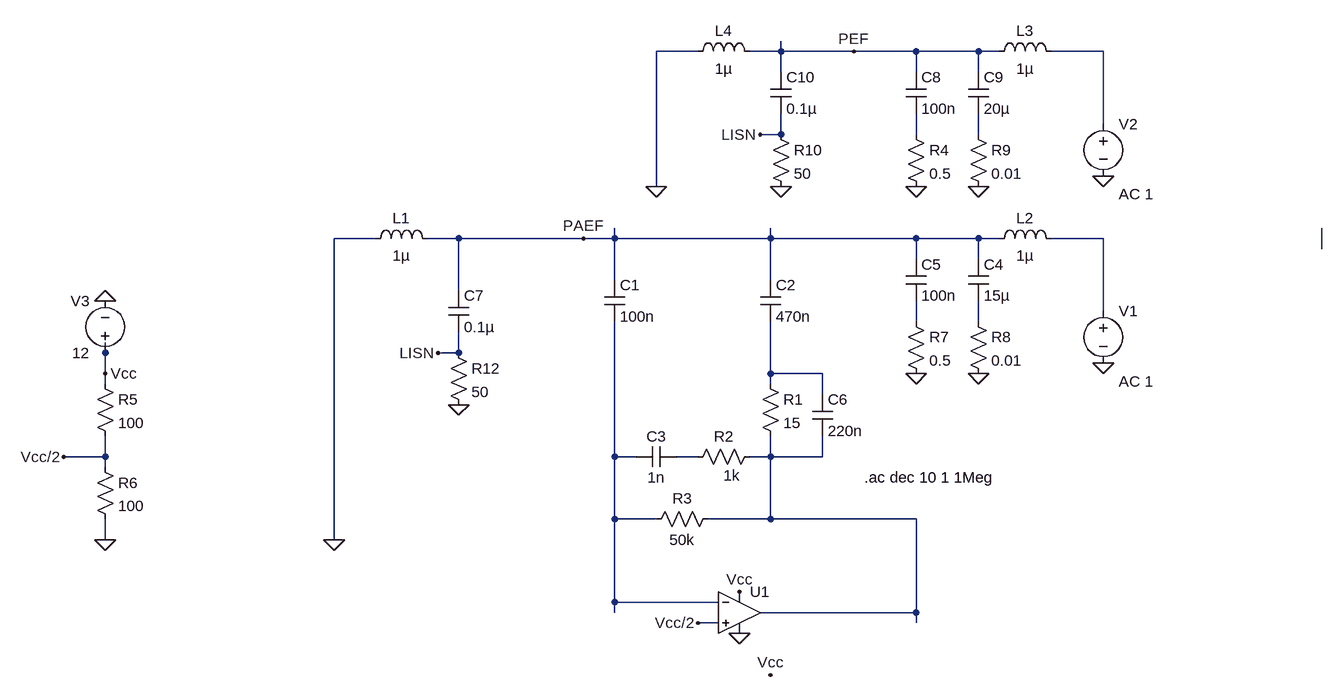
[diagram p0: schematic 440kHz-Bode.asc]
440kHz-Bode.asc, the LTspice schematic file:
Version 4
SHEET 1 3444 680
WIRE 160 -416 96 -416
WIRE 288 -416 288 -432
WIRE 288 -416 240 -416
WIRE 400 -416 288 -416
WIRE 496 -416 400 -416
WIRE 592 -416 496 -416
WIRE 624 -416 592 -416
WIRE 784 -416 704 -416
WIRE 288 -384 288 -416
WIRE 496 -384 496 -416
WIRE 592 -384 592 -416
WIRE 784 -304 784 -416
WIRE 288 -288 288 -320
WIRE 288 -288 256 -288
WIRE 496 -288 496 -320
WIRE 592 -288 592 -320
WIRE 96 -208 96 -416
WIRE -336 -128 -400 -128
WIRE -208 -128 -256 -128
WIRE -16 -128 -208 -128
WIRE 32 -128 32 -144
WIRE 32 -128 -16 -128
WIRE 272 -128 272 -144
WIRE 272 -128 32 -128
WIRE 496 -128 272 -128
WIRE 592 -128 496 -128
WIRE 624 -128 592 -128
WIRE 784 -128 704 -128
WIRE 1120 -112 1120 -144
WIRE 496 -96 496 -128
WIRE 592 -96 592 -128
WIRE 32 -64 32 -128
WIRE 272 -64 272 -128
WIRE -208 -48 -208 -128
WIRE 784 -16 784 -128
WIRE 496 0 496 -32
WIRE 592 0 592 -32
WIRE -752 48 -752 32
WIRE -208 48 -208 16
WIRE -208 48 -240 48
WIRE -752 80 -752 48
WIRE 272 80 272 0
WIRE 352 80 272 80
WIRE -752 96 -752 80
WIRE 272 96 272 80
WIRE 352 112 352 80
WIRE -752 208 -752 176
WIRE -752 208 -816 208
WIRE 32 208 32 0
WIRE 64 208 32 208
WIRE 160 208 128 208
WIRE 272 208 272 176
WIRE 272 208 240 208
WIRE 352 208 352 176
WIRE 352 208 272 208
WIRE -752 224 -752 208
WIRE 32 304 32 208
WIRE 96 304 32 304
WIRE 272 304 272 208
WIRE 272 304 176 304
WIRE 496 304 272 304
WIRE -752 336 -752 304
WIRE -400 336 -400 -128
WIRE 32 432 32 304
WIRE 192 432 32 432
WIRE 32 448 32 432
WIRE 496 448 496 304
WIRE 496 448 256 448
WIRE 192 464 160 464
WIRE 496 464 496 448
FLAG -400 336 0
FLAG -816 208 Vcc/2
FLAG -752 336 0
FLAG 496 80 0
FLAG -752 80 Vcc
FLAG 224 416 Vcc
FLAG 272 544 Vcc
FLAG 160 464 Vcc/2
FLAG 224 480 0
FLAG -752 -32 0
FLAG -208 128 0
FLAG -240 48 LISN
FLAG 784 64 0
FLAG 592 80 0
FLAG 496 -208 0
FLAG 784 -224 0
FLAG 592 -208 0
FLAG 96 -208 0
FLAG 288 -208 0
FLAG 256 -288 LISN
FLAG 400 -416 PEF
FLAG -16 -128 PAEF
DATAFLAG 128 -128 ""
DATAFLAG 400 -128 ""
DATAFLAG 752 -128 ""
DATAFLAG 752 -416 ""
DATAFLAG 752 -416 ""
SYMBOL cap 16 -64 R0
SYMATTR InstName C1
SYMATTR Value 100n
SYMBOL cap 256 -64 R0
SYMATTR InstName C2
SYMATTR Value 470n
SYMBOL res 256 80 R0
SYMATTR InstName R1
SYMATTR Value 15
SYMBOL cap 128 192 R90
WINDOW 0 0 32 VBottom 2
WINDOW 3 32 32 VTop 2
SYMATTR InstName C3
SYMATTR Value 1n
SYMBOL res 256 192 R90
WINDOW 0 0 56 VBottom 2
WINDOW 3 29 44 VTop 2
SYMATTR InstName R2
SYMATTR Value 1k
SYMBOL res 192 288 R90
WINDOW 0 0 56 VBottom 2
WINDOW 3 32 56 VTop 2
SYMATTR InstName R3
SYMATTR Value 50k
SYMBOL res -768 80 R0
SYMATTR InstName R5
SYMATTR Value 100
SYMBOL res -768 208 R0
SYMATTR InstName R6
SYMATTR Value 100
SYMBOL res 480 -16 R0
SYMATTR InstName R7
SYMATTR Value 0.5
SYMBOL voltage 784 -32 R0
WINDOW 123 24 124 Left 2
WINDOW 39 24 124 Left 2
SYMATTR Value2 AC 1
SYMATTR InstName V1
SYMATTR Value ""
SYMBOL ind -352 -112 R270
WINDOW 0 32 56 VTop 2
WINDOW 3 5 56 VBottom 2
SYMATTR InstName L1
SYMATTR Value 1µ
SYMBOL voltage -752 64 R180
WINDOW 0 24 96 Left 2
WINDOW 3 24 16 Left 2
WINDOW 123 0 0 Left 0
WINDOW 39 0 0 Left 0
SYMATTR InstName V3
SYMATTR Value 12
SYMBOL cap 480 -96 R0
SYMATTR InstName C5
SYMATTR Value 100n
SYMBOL ind 608 -112 R270
WINDOW 0 32 56 VTop 2
WINDOW 3 5 56 VBottom 2
SYMATTR InstName L2
SYMATTR Value 1µ
SYMBOL cap -224 -48 R0
SYMATTR InstName C7
SYMATTR Value 0.1µ
SYMBOL res -224 32 R0
SYMATTR InstName R12
SYMATTR Value 50
SYMBOL OpAmps\\UniversalOpamp2 224 448 R0
SYMATTR InstName U1
SYMATTR Value2 Avol=10Meg GBW=100Meg Slew=100Meg
SYMATTR SpiceLine ilimit=10 rail=0 Vos=0 phimargin=45
SYMBOL cap 336 112 R0
SYMATTR InstName C6
SYMATTR Value 220n
SYMBOL cap 576 -96 R0
SYMATTR InstName C4
SYMATTR Value 15µ
SYMBOL res 576 -16 R0
SYMATTR InstName R8
SYMATTR Value 0.01
SYMBOL res 480 -304 R0
SYMATTR InstName R4
SYMATTR Value 0.5
SYMBOL voltage 784 -320 R0
WINDOW 123 24 124 Left 2
WINDOW 39 24 124 Left 2
SYMATTR Value2 AC 1
SYMATTR InstName V2
SYMATTR Value ""
SYMBOL cap 480 -384 R0
SYMATTR InstName C8
SYMATTR Value 100n
SYMBOL ind 608 -400 R270
WINDOW 0 32 56 VTop 2
WINDOW 3 5 56 VBottom 2
SYMATTR InstName L3
SYMATTR Value 1µ
SYMBOL cap 576 -384 R0
SYMATTR InstName C9
SYMATTR Value 20µ
SYMBOL res 576 -304 R0
SYMATTR InstName R9
SYMATTR Value 0.01
SYMBOL ind 144 -400 R270
WINDOW 0 32 56 VTop 2
WINDOW 3 5 56 VBottom 2
SYMATTR InstName L4
SYMATTR Value 1µ
SYMBOL cap 272 -384 R0
SYMATTR InstName C10
SYMATTR Value 0.1µ
SYMBOL res 272 -304 R0
SYMATTR InstName R10
SYMATTR Value 50
TEXT 416 240 Left 2 !.ac dec 10 1 1Meg

The netlist it stands for:
* 440kHz-Bode.asc
C1 PAEF N009 100n
C2 PAEF N008 470n
R1 N008 N011 15
C3 N010 N009 1n
R2 N011 N010 1k
R3 N011 N009 50k
R5 Vcc Vcc/2 100
R6 Vcc/2 0 100
R7 N006 0 0.5
V1 N004 0 AC 1
L1 0 PAEF 1µ
V3 Vcc 0 12
C5 PAEF N006 100n
L2 PAEF N004 1µ
C7 PAEF LISN 0.1µ
R12 LISN 0 50
XU1 Vcc/2 N009 Vcc 0 N011 level.2 Avol=10Meg GBW=100Meg Slew=100Meg ilimit=10 rail=0 Vos=0 phimargin=45 en=0 enk=0 in=0 ink=0 Rin=500Meg  ; pins IN+ IN- V+ V- OUT
C6 N008 N011 220n
C4 PAEF N007 15µ
R8 N007 0 0.01
R4 N002 0 0.5
V2 N001 0 AC 1
C8 PEF N002 100n
L3 PEF N001 1µ
C9 PEF N003 20µ
R9 N003 0 0.01
L4 0 PEF 1µ
C10 PEF LISN 0.1µ
R10 LISN 0 50
.ac dec 10 1 1Meg
.lib UniversalOpamps2.sub
.backanno
.end